# Altium schematic sheet Sheet2.SchDoc
size A3
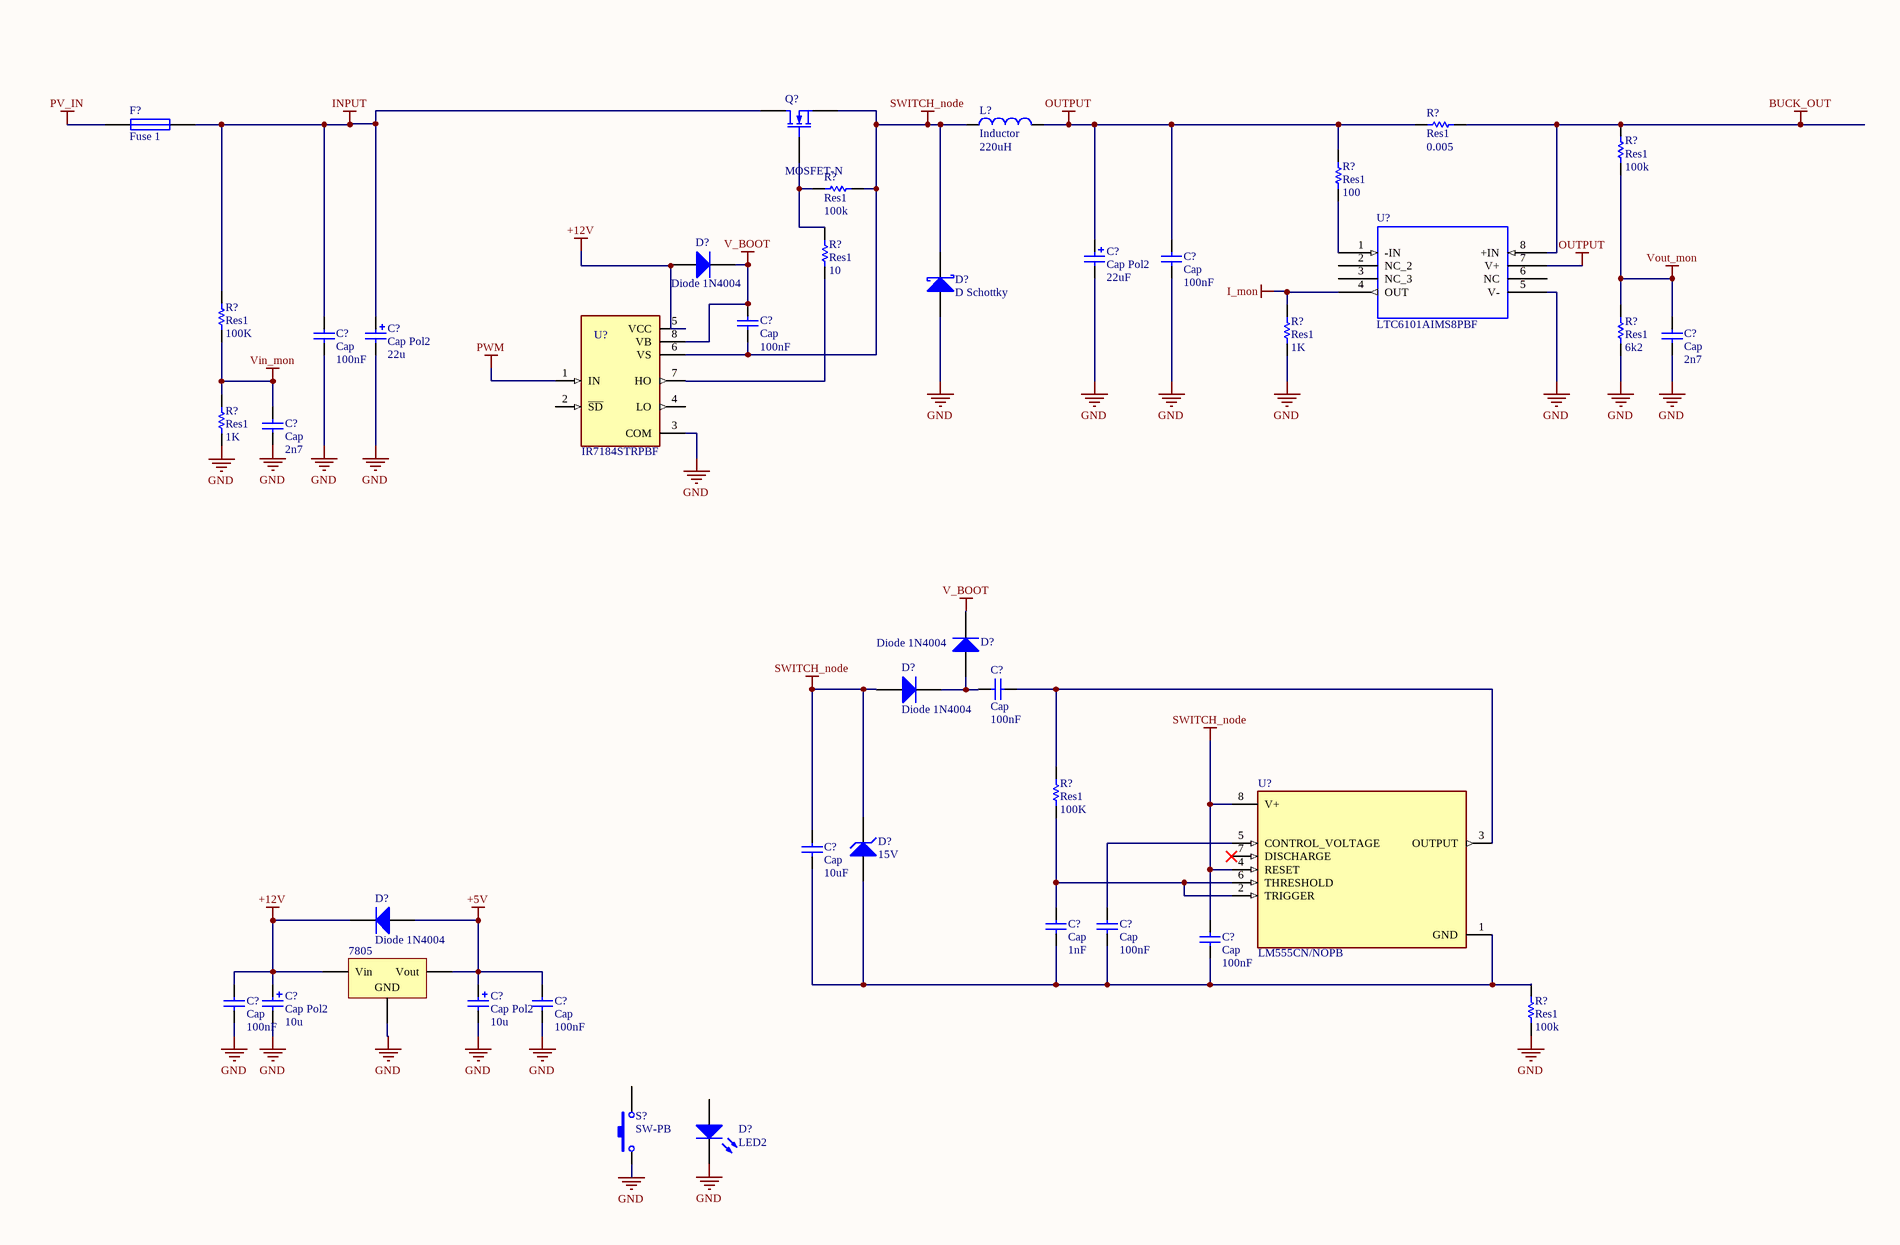
[diagram p0: Sheet2.SchDoc, bottom]

## Parts
(Parts that share a designator on the sheet are numbered #1, #2 ... from top to bottom, then left to right.)
7805  Volt Reg  [D2PAK_N]  (value not drawn)
C?#1  Cap Pol2  value 22uF  [POLAR0.8]
C?#2  Cap  value 100nF  [RAD-0.3]
C?#3  Cap Pol2  value 22u  [POLAR0.8]
C?#4  Cap  value 100nF  [RAD-0.3]
C?#5  Cap  value 100nF  [RAD-0.3]
C?#6  Cap  value 2n7  [RAD-0.3]
C?#7  Cap  value 2n7  [RAD-0.3]
C?#8  Cap  value 100nF  [RAD-0.3]
C?#9  Cap  value 10uF  [RAD-0.3]
C?#10  Cap  value 1nF  [RAD-0.3]
C?#11  Cap  value 100nF  [RAD-0.3]
C?#12  Cap  value 100nF  [RAD-0.3]
C?#13  Cap Pol2  value 10u  [POLAR0.8]
C?#14  Cap Pol2  value 10u  [POLAR0.8]
C?#15  Cap  value 100nF  [RAD-0.3]
C?#16  Cap  value 100nF  [RAD-0.3]
D?#1  Diode 1N4004  [DO-41]
D?#2  D Schottky  [SMB]
D?#3  Diode 1N4004  [DO-41]
D?#4  Diode 1N4004  [DO-41]
D?#5  15V  [DIODE-0.7]
D?#6  Diode 1N4004  [DO-41]
D?#7  LED2  [3.2X1.6X1.1]
F?  Fuse 1  [PIN-W2/E2.8]
L?  Inductor  value 220uH  [0402-A]
Q?  MOSFET-N  [E3]
R?#1  Res1  value 0.005  [AXIAL-0.3]
R?#2  Res1  value 100k  [AXIAL-0.3]
R?#3  Res1  value 100  [AXIAL-0.3]
R?#4  Res1  value 100k  [AXIAL-0.3]
R?#5  Res1  value 10  [AXIAL-0.3]
R?#6  Res1  value 100K  [AXIAL-0.3]
R?#7  Res1  value 1K  [AXIAL-0.3]
R?#8  Res1  value 6k2  [AXIAL-0.3]
R?#9  Res1  value 1K  [AXIAL-0.3]
R?#10  Res1  value 100K  [AXIAL-0.3]
R?#11  Res1  value 100k  [AXIAL-0.3]
S?  SW-PB  [SPST-2]
U?#1  LTC6101AIMS8PBF  [MSOP-8_MS]
U?#2  IR7184STRPBF  [SOIC127P600X175-8N]
U?#3  LM555CN/NOPB  [DIP794W45P254L959H508Q8]

## Nets
+5V: 7805.3(Vout) C?#14.1 C?#16.2 D?#6.1(A)
+12V: 7805.1(Vin) C?#13.1 C?#15.2 D?#1.1(A) D?#6.2(K) U?#2.5(VCC)
BUCK_OUT: R?#1.1 R?#2.2 U?#1.8(+IN)
GND: 7805.2(GND) C?#1.2 C?#2.1 C?#3.2 C?#5.1 C?#6.1 C?#7.1 C?#13.2 C?#14.2 C?#15.1 C?#16.1 D?#2.1(A) D?#7.2(K) R?#7.1 R?#8.1 R?#9.1 R?#11.2 S?.1 U?#1.5(V-) U?#2.3(COM)
I_mon: R?#7.2 U?#1.4(OUT)
INPUT: C?#3.1 C?#5.2 F?.2 Q?.1(D) R?#6.2
OUTPUT: C?#1.1 C?#2.2 L?.2 R?#1.2 R?#3.2 U?#1.7(V+)
PV_IN: F?.1
PWM: U?#2.1(IN)
SWITCH_node: C?#4.1 C?#9.2 C?#12.2 D?#2.2(K) D?#4.1(A) D?#5.2(K) L?.1 Q?.3(S) R?#4.1 U?#2.6(VS) U?#3.4(RESET) U?#3.8(V+)
V_BOOT: C?#4.2 D?#1.2(K) D?#3.2(K) U?#2.8(VB)
Vin_mon: C?#7.2 R?#6.1 R?#9.2
Vout_mon: C?#6.2 R?#2.1 R?#8.2
NetC?#8_1: C?#8.1 R?#10.2 U?#3.3(OUTPUT)
NetC?#8_2: C?#8.2 D?#3.1(A) D?#4.2(K)
NetC?#9_1: C?#9.1 C?#10.1 C?#11.1 C?#12.1 D?#5.1(A) R?#11.1 U?#3.1(GND)
NetC?#10_2: C?#10.2 R?#10.1 U?#3.2(TRIGGER) U?#3.6(THRESHOLD)
NetC?#11_2: C?#11.2 U?#3.5(CONTROL_VOLTAGE)
NetQ?_2: Q?.2(G) R?#4.2 R?#5.2
NetR?#3_1: R?#3.1 U?#1.1(-IN)
NetR?#5_1: R?#5.1 U?#2.7(HO)

Not connected (* = marked no-connect by the designer): D?#7 1(A); S? 2; U?#1 2(NC_2) 3(NC_3) 6(NC); U?#2 2(~{SD}) 4(LO); U?#3 7(DISCHARGE)*

## Library data of the parts
7805 = Volt Reg: Voltage Regulator; Published: 24-Mar-1999; LatestRevisionDate: 29-May-2009; LatestRevisionNote: IPC-7351 Footprint Added.; PackageReference: D2PAK; Publisher: Altium Limited; PackageDescription: 3-Pin Transistor Outline Package 2.54 mm Pitch, 15.1 mm Lead Span
C?#1 C?#3 C?#13 C?#14 = Cap Pol2: Polarized Capacitor (Axial); Published: 8-Jun-2000; LatestRevisionDate: 17-Jul-2002; LatestRevisionNote: Re-released for DXP Platform.; PackageReference: POLAR0.8; Publisher: Altium Limited; PackageDescription: Polarized Capacitor; 2 Leads
C?#2 C?#4-C?#12 C?#15 C?#16 = Cap: Capacitor; Published: 8-Jun-2000; LatestRevisionDate: 17-Jul-2002; LatestRevisionNote: Re-released for DXP Platform.; PackageReference: RAD-0.3; Publisher: Altium Limited; PackageDescription: Radial Cap, Thru-Hole; 2 Leads; 0.3 in Pin Spacing
D?#1 D?#3 D?#4 D?#6 = Diode 1N4004: 1 Amp General Purpose Rectifier; Published: 8-Jun-2000; LatestRevisionDate: 17-Jul-2002; LatestRevisionNote: Re-released for DXP Platform.; DatasheetVersion: 1998; PackageVersion: Aug-1999; PackageReference: DO-41; Publisher: Altium Limited; PackageDescription: Diode, Axial; Body 5.2 x 2.7 mm (LxDia. max), Lead Dia. 0.86 mm (max); Code_JEDEC: DO-204-AL; ComponentLink1Description: Manufacturer Link; ComponentLink1URL: http://www.fairchildsemi.com/; ComponentLink2Description: Datasheet; ComponentLink2URL: http://www.fairchildsemi.com/ds/1N%2F1N4001.pdf
D?#2 = D Schottky: Schottky Diode; Published: 8-Jun-2000; LatestRevisionDate: 17-Jul-2002; LatestRevisionNote: Re-released for DXP Platform.; PackageReference: SMB; Publisher: Altium Limited; PackageDescription: DO-214-AA/SMB; 2 C-Bend Leads; Body 5.3 x 3.6 mm, inc. leads (LxW); Code_JEDEC: DO-214-AA
D?#5 = D Zener: Zener Diode; Published: 8-Jun-2000; LatestRevisionDate: 17-Jul-2002; LatestRevisionNote: Re-released for DXP Platform.; PackageReference: DIODE-0.7; Publisher: Altium Limited; PackageDescription: Diode, Thru-Hole; 2 Leads; 0.7 in Pin Spacing
D?#7 = LED2: Typical RED, GREEN, YELLOW, AMBER GaAs LED; Published: 8-Jun-2000; LatestRevisionDate: 17-Jul-2002; LatestRevisionNote: Re-released for DXP Platform.; PackageVersion: Feb-2002; PackageReference: 3.2X1.6X1.1; Publisher: Altium Limited; PackageDescription: SM LED; 2 Flat Leads
F? = Fuse 1: Fuse; Published: 8-Jun-2000; LatestRevisionDate: 17-Jul-2002; LatestRevisionNote: Re-released for DXP Platform.; PackageReference: PIN-W2/E2.8; Publisher: Altium Limited; PackageDescription: Thru-Hole; 2 Leads
L? = Inductor: Code_IEC: 1005; Published: 8-Jun-2000; LatestRevisionDate: 29-May-2009; LatestRevisionNote: IPC-7351 Footprint Added.; PackageReference: 0402-A; Publisher: Altium Limited; PackageDescription: Chip Inductor; Code_JEITA: 0402
Q? = MOSFET-N: N-Channel MOSFET; Published: 8-Jun-2000; LatestRevisionDate: 17-Jul-2002; LatestRevisionNote: Re-released for DXP Platform.; PackageVersion: 1995/1996; PackageReference: E3; Publisher: Altium Limited; PackageDescription: TO, Flat Index; 3 In-Line, Axial Leads; Body Dia. 4.6mm; Lead Dia. 0.5 mm (max)
R?#1-R?#11 = Res1: Resistor; Published: 8-Jun-2000; LatestRevisionDate: 17-Jul-2002; LatestRevisionNote: Re-released for DXP Platform.; PackageReference: AXIAL-0.3; Publisher: Altium Limited; PackageDescription: Axial Device, Thru-Hole; 2 Leads; 0.3 in Pin Spacing
S? = SW-PB: Switch; Published: 24-Mar-1999; LatestRevisionDate: 17-Jul-2002; LatestRevisionNote: Re-released for DXP Platform.; PackageReference: SPST-2; Publisher: Altium Limited; PackageDescription: Switch; 2 Leads
U?#1 = LTC6101AIMS8PBF: SP Amp Current Sense Amp Single 60V Automotive 8-Pin MSOP Tube; MP: LTC6101AIMS8#PBF; MF: Analog Devices; SnapEDA_Link: https://www.snapeda.com/parts/LTC6101AIMS8%23PBF/Analog%20Devices/view-part/4331140/?ref=snap; Price: None; Purchase-URL: https://pricing.snapeda.com/search/part/LTC6101AIMS8#PBF/?ref=eda; Package: MSOP-8 Analog Devices; Availability: Warning; Value: *; Check_prices: https://www.snapeda.com/parts/LTC6101AIMS8%23PBF/Analog%20Devices/view-part/4331140/?ref=eda
U?#2 = IR7184STRPBF: Drives IGBT/MOSFET power devices | Gate drive supplies up to 20 V per channel | Integrated deadtime protection | Shoot-through _cross-conduction_ protection | Undervoltage lockout for VCC for VBS | 3.3 V, 5 V , 15 V input logic compatible | Tolerant to negative transient voltage | Designed for use with bootstrap power supplies | Matched propagation delays | -40C to 125C operating range; MF: Infineon Technologies; Value: *; MP: IR7184STRPBF; Package: SOIC-8 Infineon; Price: None; Availability: Unavailable; SnapEDA_Link: https://www.snapeda.com/parts/IR7184STRPBF/Infineon%20Technologies/view-part/1224754/?ref=snap
U?#3 = LM555CN/NOPB: Value: *; Availability: Unavailable; Package: None; MP: LM555CN/NOPB; Price: None